# EAGLE schematic rev0.1 parts placement (EAGLE 8.6.0)

## Sheet 1 of 2
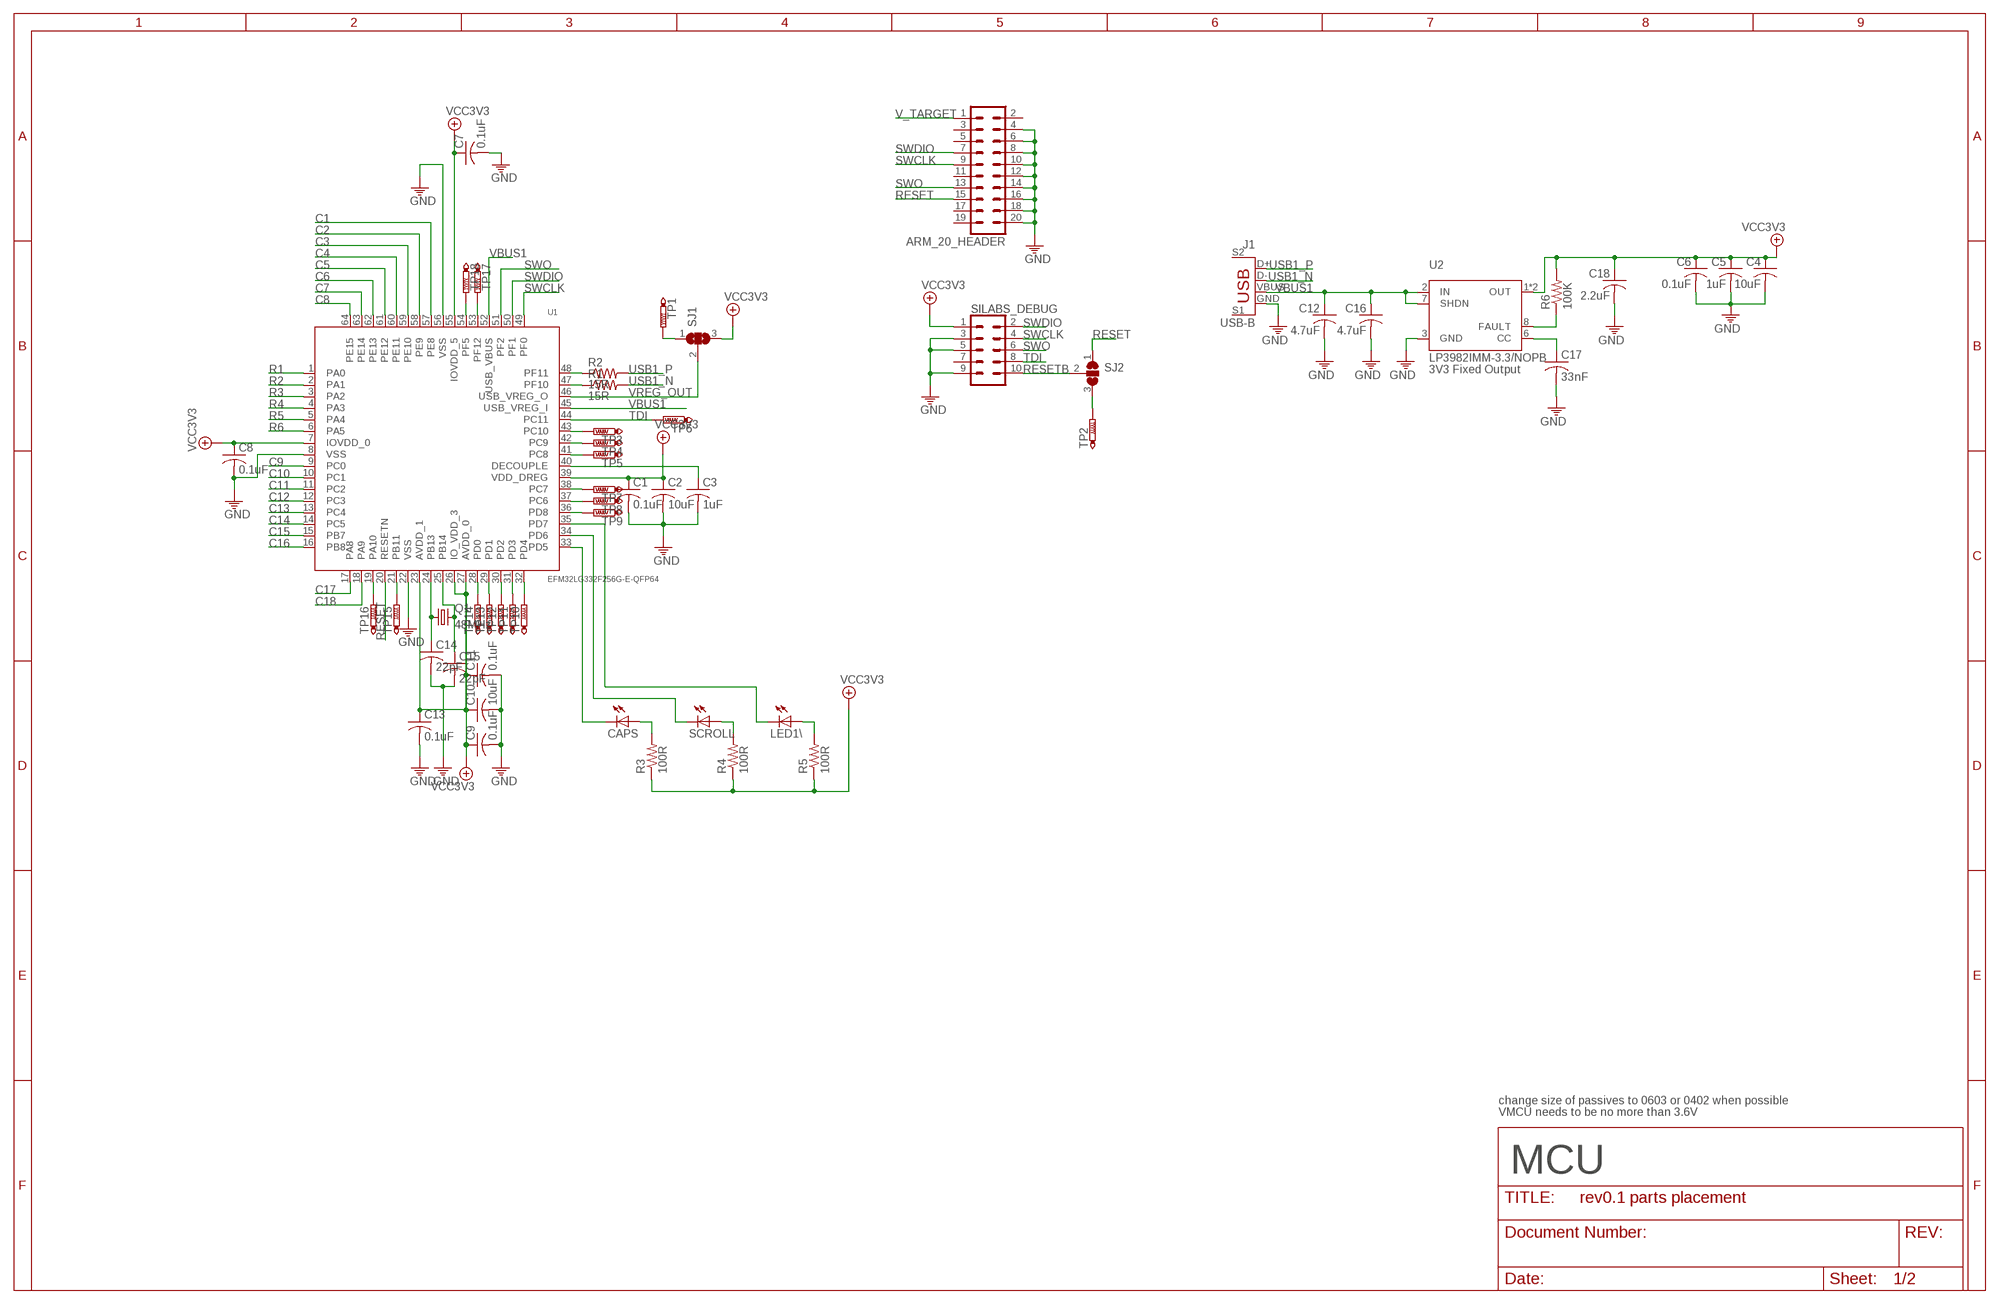
[diagram p0: schematic, sheet 1]

### Parts
ARM_20_HEADER  MA10-2  [MA10-2]
C1  0.1uF  C-USC0402  [C0402]
C2  10uF  C-USC0805  [C0805]
C3  1uF  C-USC0402  [C0402]
C4  10uF  C-USC0805  [C0805]
C5  1uF  C-USC0402  [C0402]
C6  0.1uF  C-USC0402  [C0402]
C7  0.1uF  C-USC0402  [C0402]
C8  0.1uF  C-USC0402  [C0402]
C9  0.1uF  C-USC0402  [C0402]
C10  10uF  C-USC0805  [C0805]
C11  0.1uF  C-USC0402  [C0402]
C12  4.7uF  C-USC0805  [C0805]
C13  0.1uF  C-USC0402  [C0402]
C14  22pF  C-USC0402  [C0402]
C15  22pF  C-USC0402  [C0402]
C16  4.7uF  C-USC0805  [C0805]
C17  33nF  C-USC0402  [C0402]
C18  2.2uF  C-USC0805  [C0805]
CAPS  LEDCHIP-LED0805  [CHIP-LED0805]
J1  USB-B  USBPTH  [USB-B-PTH]
LED1\  LEDCHIP-LED0805  [CHIP-LED0805]
Q1  48MHz  CRYSTALCTS406  [CTS406]
R1  15R  R-US_R0402  [R0402]
R2  15R  R-US_R0402  [R0402]
R3  100R  R-US_R0402  [R0402]
R4  100R  R-US_R0402  [R0402]
R5  100R  R-US_R0402  [R0402]
R6  100K  R-US_R0402  [R0402]
SCROLL  LEDCHIP-LED0805  [CHIP-LED0805]
SILABS_DEBUG  CONN_05X2SHD_LOCK  [2X5-SHROUDED_LOCK]
SJ1  SJ2W  [SJ_2]
SJ2  SJ2W  [SJ_2]
TP1  PTR1B2,54  [B2,54]
TP2  PTR1B2,54  [B2,54]
TP3  PTR1B1,27  [B1,27]
TP4  PTR1B1,27  [B1,27]
TP5  PTR1B1,27  [B1,27]
TP6  PTR1B1,27  [B1,27]
TP7  PTR1B1,27  [B1,27]
TP8  PTR1B1,27  [B1,27]
TP9  PTR1B1,27  [B1,27]
TP10  PTR1B1,27  [B1,27]
TP11  PTR1B1,27  [B1,27]
TP12  PTR1B1,27  [B1,27]
TP13  PTR1B1,27  [B1,27]
TP14  PTR1B1,27  [B1,27]
TP15  PTR1B1,27  [B1,27]
TP16  PTR1B1,27  [B1,27]
TP17  PTR1B1,27  [B1,27]
TP18  PTR1B1,27  [B1,27]
U1  EFM32LG332F256G-E-QFP64  [EFM32LG332F256G-E-QFP64]
U2  LP3982IMM-3.3/NOPB  [LP3982IMM-3.3/NOPB]

### Nets
1_N: R1.1 U1.47(PF10)
1_P: R2.1 U1.48(PF11)
C1: U1.57(PE8) ; also sheet 2
C2: U1.58(PE9) ; also sheet 2
C3: U1.59(PE10) ; also sheet 2
C4: U1.60(PE11) ; also sheet 2
C5: U1.61(PE12) ; also sheet 2
C6: U1.62(PE13) ; also sheet 2
C7: U1.63(PE14) ; also sheet 2
C8: U1.64(PE15) ; also sheet 2
C9: U1.9(PC0) ; also sheet 2
C10: U1.10(PC1) ; also sheet 2
C11: U1.11(PC2) ; also sheet 2
C12: U1.12(PC3) ; also sheet 2
C13: U1.13(PC4) ; also sheet 2
C14: U1.14(PC5) ; also sheet 2
C15: U1.15(PB7) ; also sheet 2
C16: U1.16(PB8) ; also sheet 2
C17: U1.17(PA8) ; also sheet 2
C18: U1.18(PA9) ; also sheet 2
GND: ARM_20_HEADER.4 ARM_20_HEADER.6 ARM_20_HEADER.8 ARM_20_HEADER.10 ARM_20_HEADER.12 ARM_20_HEADER.14 ARM_20_HEADER.16 ARM_20_HEADER.18 ARM_20_HEADER.20 C1.2 C2.2 C3.2 C4.2 C5.2 C6.2 C7.2 C8.2 C9.2 C10.2 C11.2 C12.2 C13.2 C14.2 C15.2 C16.2 C17.2 C18.2 J1.GND SILABS_DEBUG.3 SILABS_DEBUG.5 SILABS_DEBUG.9 U1.8(VSS) U1.22(VSS) U1.56(VSS) U2.3(GND)
N$1: SJ1.1 TP1.TP
N$2: C3.1 U1.40(DECOUPLE)
N$3: C15.1 Q1.3 U1.25(PB14)
N$4: C14.1 Q1.1 U1.24(PB13)
N$5: SJ2.3 TP2.TP
N$24: CAPS.A R3.2
N$25: R4.2 SCROLL.A
N$26: LED1\.A R5.2
N$27: CAPS.C U1.33(PD5)
N$28: SCROLL.C U1.34(PD6)
N$29: LED1\.C U1.35(PD7)
N$30: TP16.TP U1.19(PA10)
N$31: C17.1 U2.6(CC)
N$32: R6.1 U2.8(FAULT)
N$33: TP15.TP U1.21(PB11)
N$34: TP14.TP U1.28(PD0)
N$35: TP13.TP U1.29(PD1)
N$110: TP12.TP U1.30(PD2)
N$111: TP11.TP U1.31(PD3)
N$112: TP10.TP U1.32(PD4)
N$113: TP9.TP U1.36(PD8)
N$114: TP8.TP U1.37(PC6)
N$115: TP7.TP U1.38(PC7)
N$116: TP5.TP U1.41(PC8)
N$117: TP4.TP U1.42(PC9)
N$118: TP3.TP U1.43(PC10)
N$119: TP17.TP U1.53(PF12)
N$120: TP18.TP U1.54(PF5)
R1: U1.1(PA0) ; also sheet 2
R2: U1.2(PA1) ; also sheet 2
R3: U1.3(PA2) ; also sheet 2
R4: U1.4(PA3) ; also sheet 2
R5: U1.5(PA4) ; also sheet 2
R6: U1.6(PA5) ; also sheet 2
RESET: ARM_20_HEADER.15 SJ2.1 U1.20(RESETN)
RESETB: SILABS_DEBUG.10 SJ2.2
SWCLK: ARM_20_HEADER.9 SILABS_DEBUG.4 U1.49(PF0)
SWDIO: ARM_20_HEADER.7 SILABS_DEBUG.2 U1.50(PF1)
SWO: ARM_20_HEADER.13 SILABS_DEBUG.6 U1.51(PF2)
TDI: SILABS_DEBUG.8 TP6.TP U1.44(PC11)
USB1_N: J1.D- R1.2
USB1_P: J1.D+ R2.2
V_TARGET: ARM_20_HEADER.1
VBUS1: C12.1 C16.1 J1.VBUS U1.45(USB_VREG_I) U1.52(USB_VBUS) U2.2(IN) U2.7(SHDN)
VCC3V3: C1.1 C2.1 C4.1 C5.1 C6.1 C7.1 C8.1 C9.1 C10.1 C11.1 C13.1 C18.1 R3.1 R4.1 R5.1 R6.2 SILABS_DEBUG.1 SJ1.3 U1.7(IOVDD_0) U1.23(AVDD_1) U1.26(IO_VDD_3) U1.27(AVDD_0) U1.39(VDD_DREG) U1.55(IOVDD_5) U2.1(OUT) U2.4(OUT)
VREG_OUT: SJ1.2 U1.46(USB_VREG_O)
Unconnected: ARM_20_HEADER.2 ARM_20_HEADER.3 ARM_20_HEADER.5 ARM_20_HEADER.11 ARM_20_HEADER.17 ARM_20_HEADER.19 J1.S1(GND) J1.S2(GND) SILABS_DEBUG.7

### Notes on the sheet
- 3V3 Fixed Output
- change size of passives to 0603 or 0402 when possible
- VMCU needs to be no more than 3.6V
- MCU

## Sheet 2 of 2
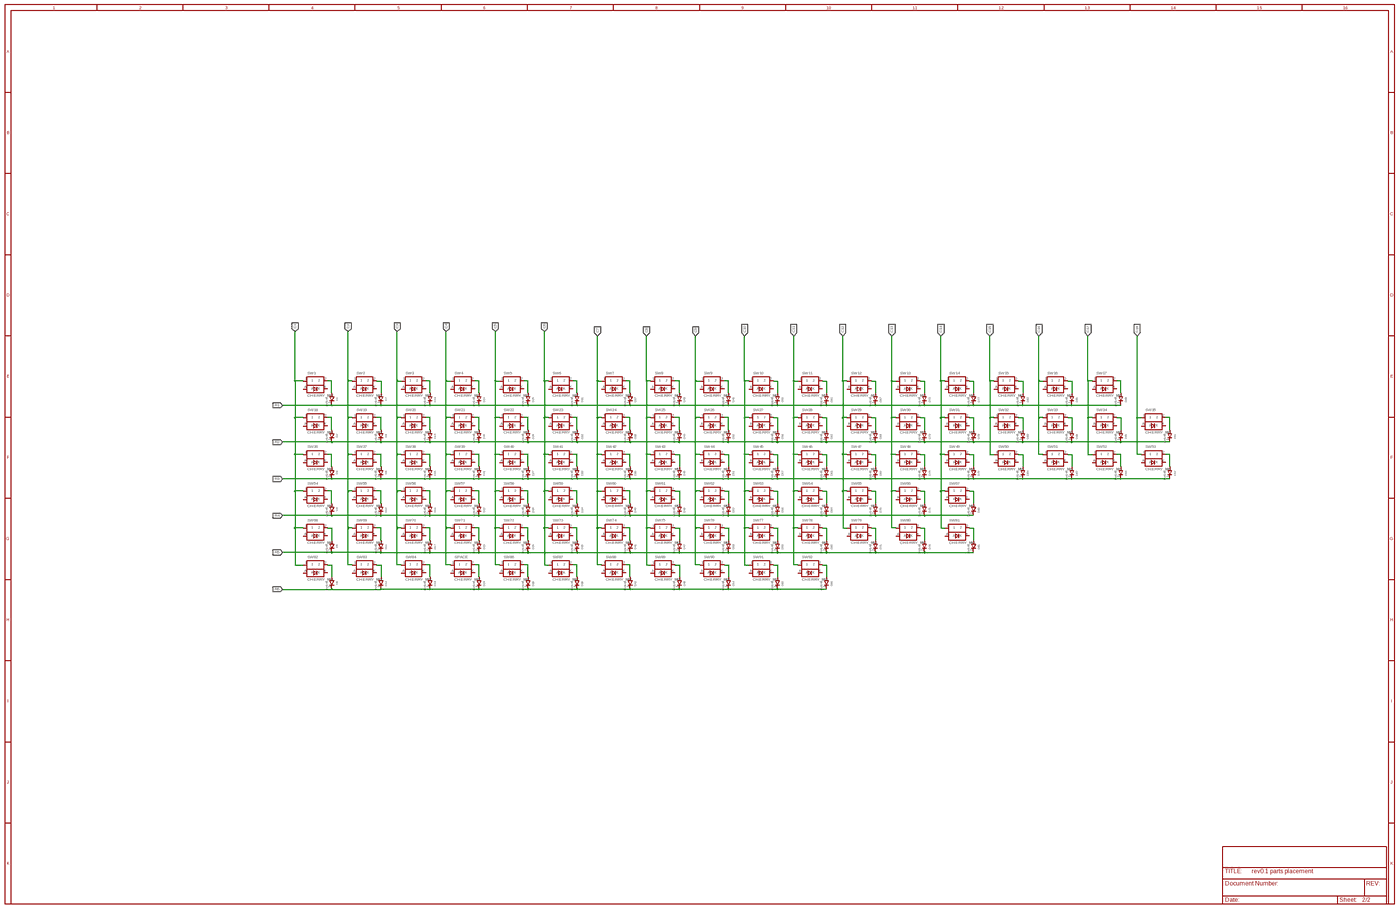
[diagram p1: schematic, sheet 2, overview]
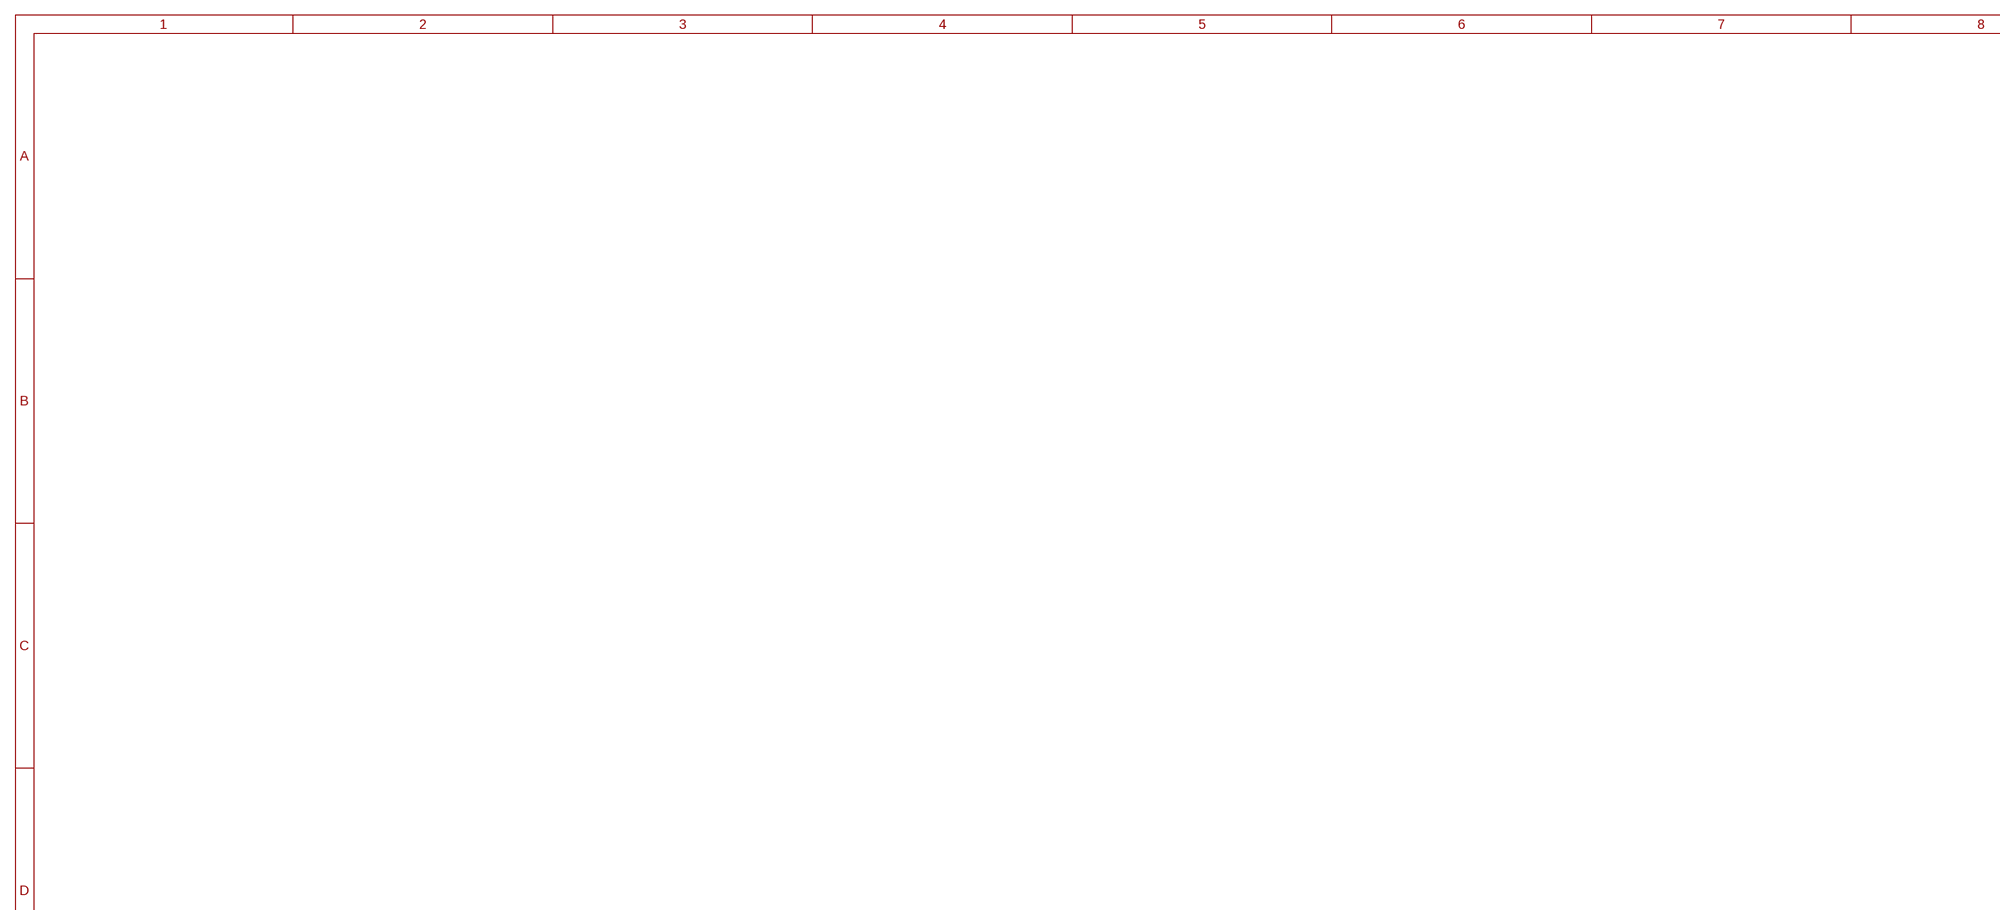
[diagram p2: schematic, sheet 2, part 1 of 4]
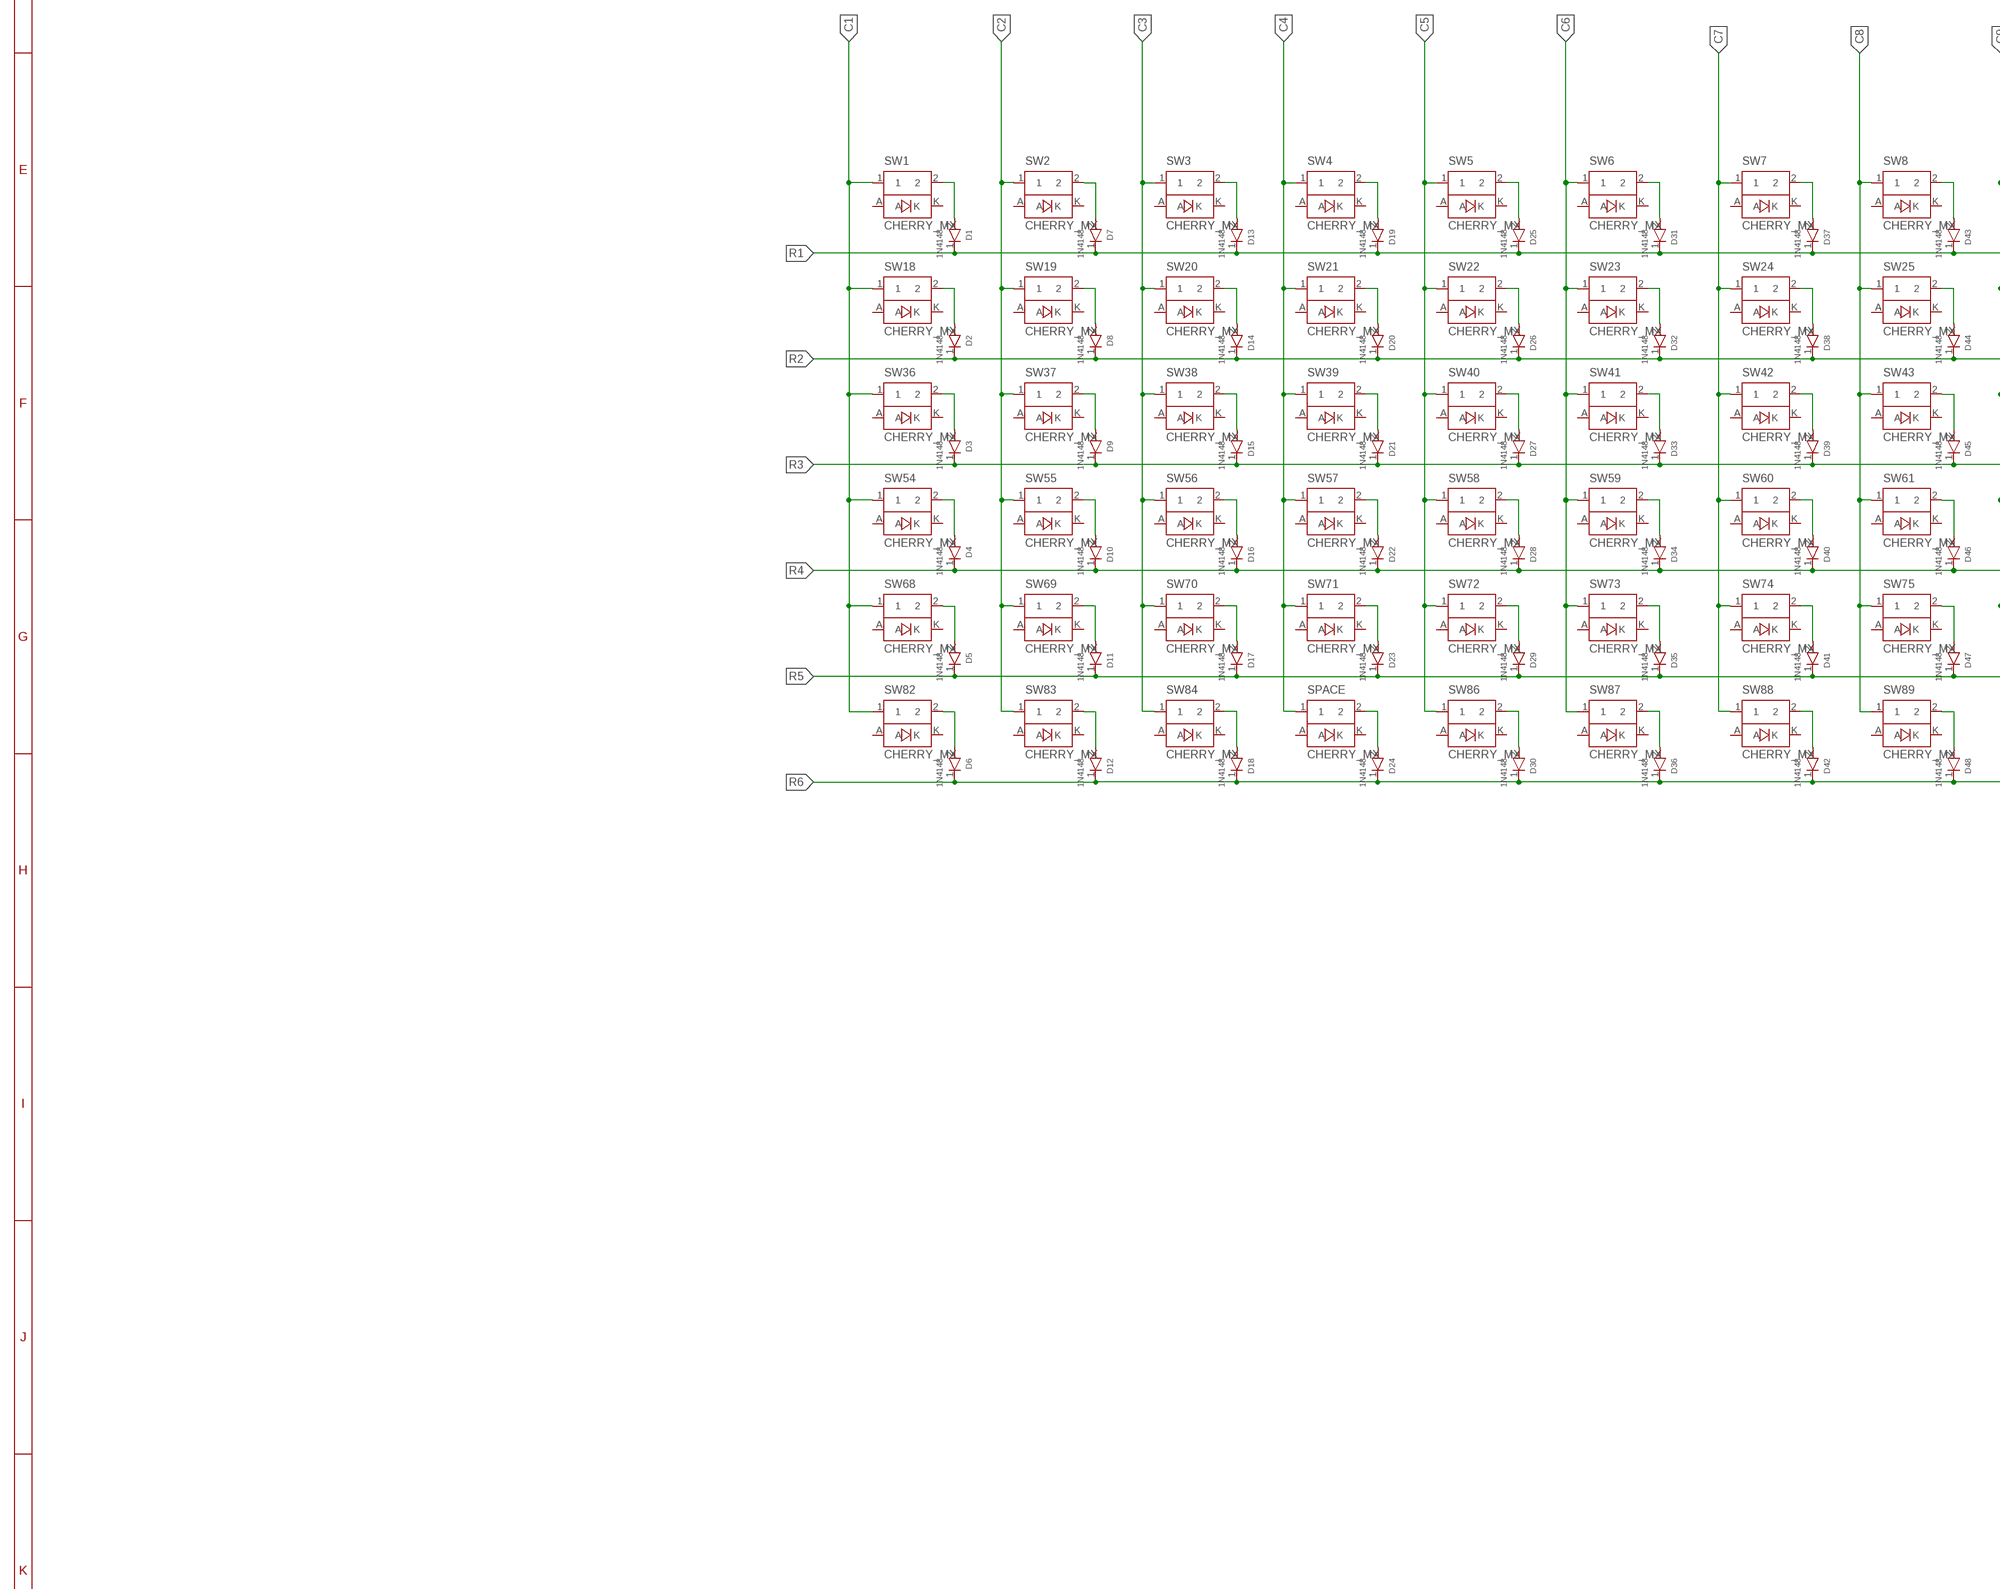
[diagram p3: schematic, sheet 2, part 2 of 4]
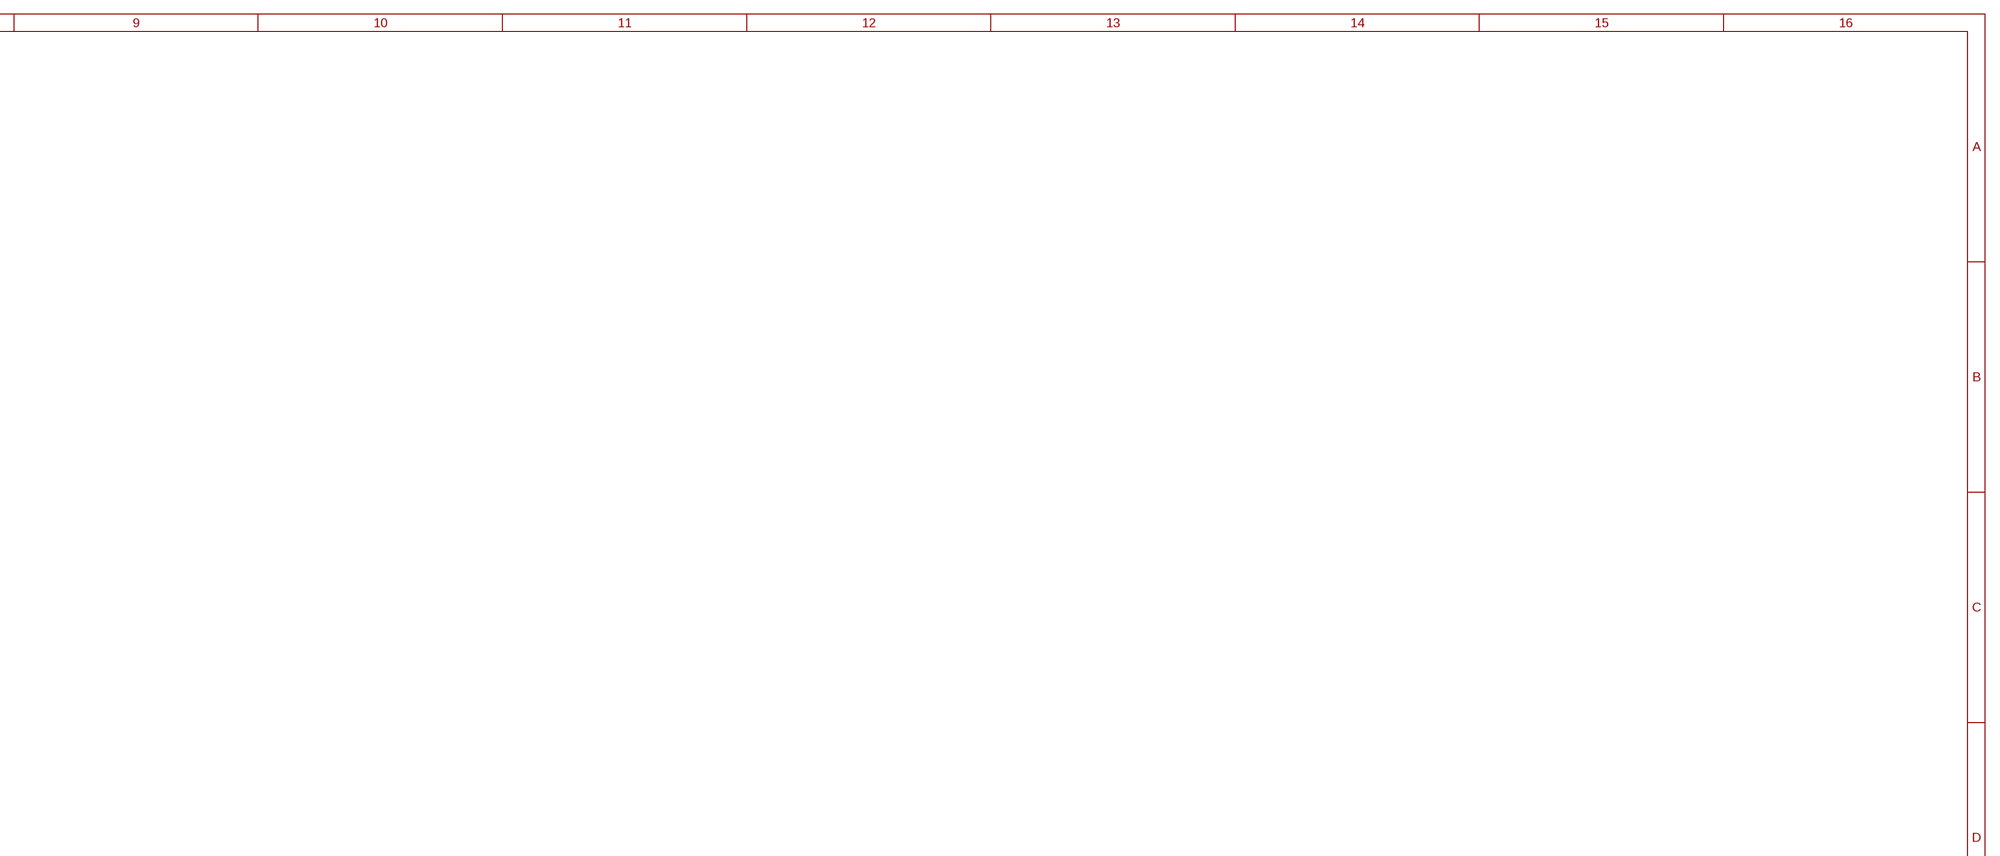
[diagram p4: schematic, sheet 2, part 3 of 4]
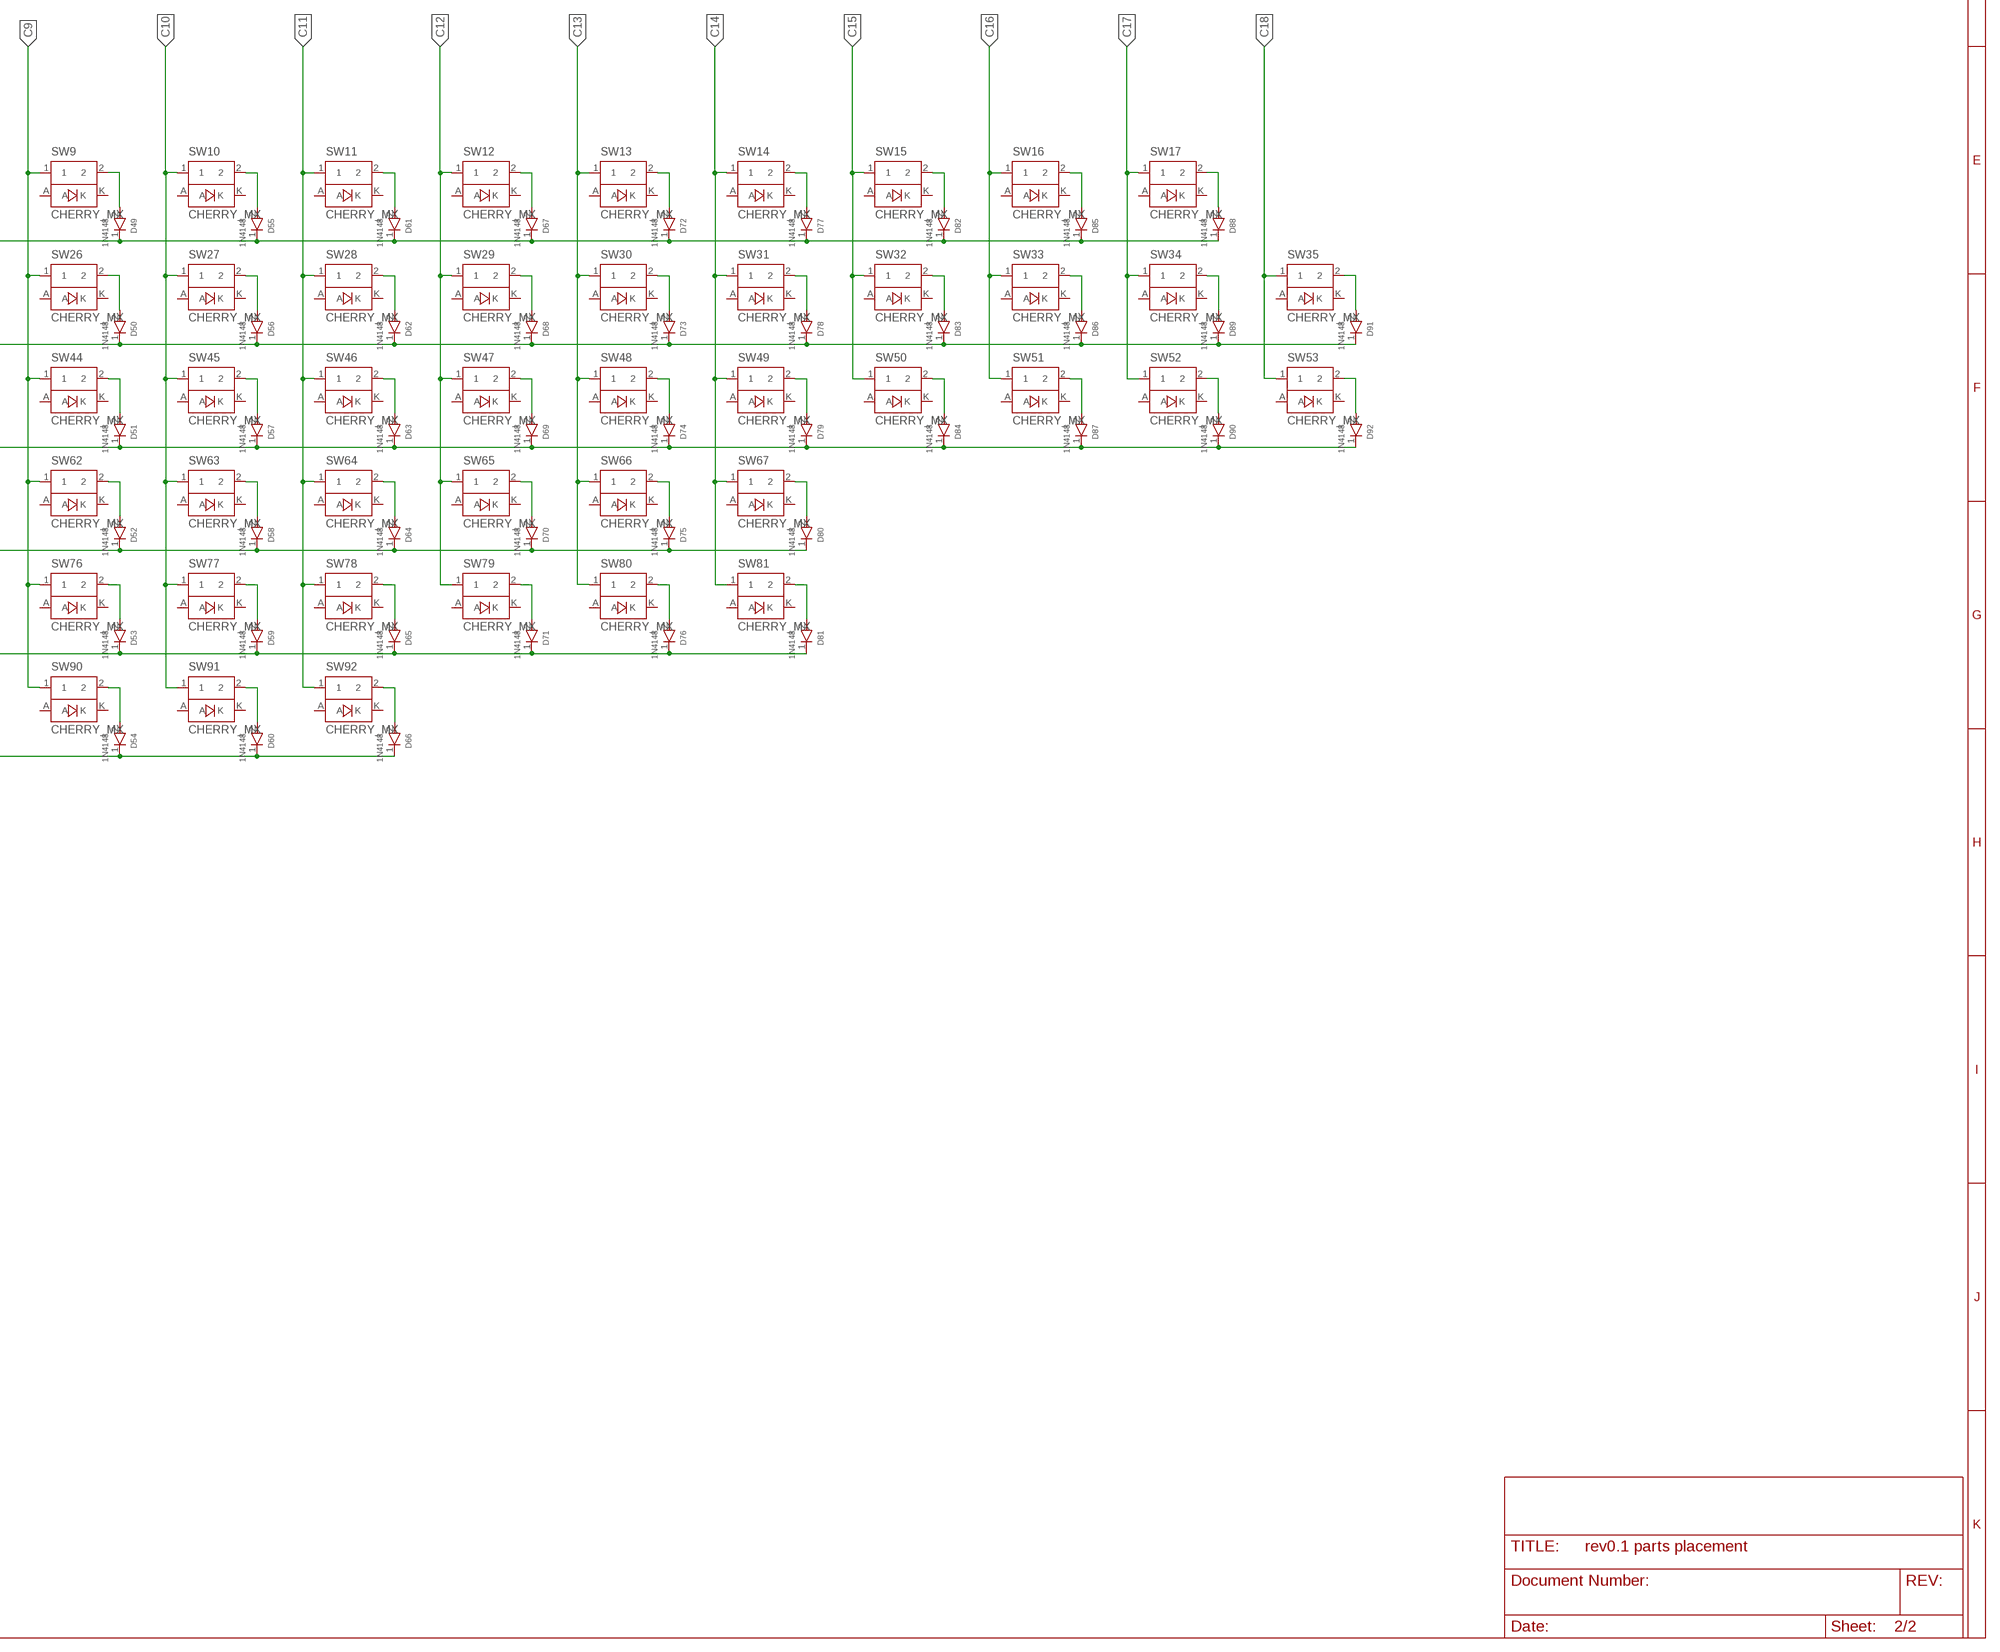
[diagram p5: schematic, sheet 2, part 4 of 4]

### Parts
D1  1N4148  [SOD323]
D2  1N4148  [SOD323]
D3  1N4148  [SOD323]
D4  1N4148  [SOD323]
D5  1N4148  [SOD323]
D6  1N4148  [SOD323]
D7  1N4148  [SOD323]
D8  1N4148  [SOD323]
D9  1N4148  [SOD323]
D10  1N4148  [SOD323]
D11  1N4148  [SOD323]
D12  1N4148  [SOD323]
D13  1N4148  [SOD323]
D14  1N4148  [SOD323]
D15  1N4148  [SOD323]
D16  1N4148  [SOD323]
D17  1N4148  [SOD323]
D18  1N4148  [SOD323]
D19  1N4148  [SOD323]
D20  1N4148  [SOD323]
D21  1N4148  [SOD323]
D22  1N4148  [SOD323]
D23  1N4148  [SOD323]
D24  1N4148  [SOD323]
D25  1N4148  [SOD323]
D26  1N4148  [SOD323]
D27  1N4148  [SOD323]
D28  1N4148  [SOD323]
D29  1N4148  [SOD323]
D30  1N4148  [SOD323]
D31  1N4148  [SOD323]
D32  1N4148  [SOD323]
D33  1N4148  [SOD323]
D34  1N4148  [SOD323]
D35  1N4148  [SOD323]
D36  1N4148  [SOD323]
D37  1N4148  [SOD323]
D38  1N4148  [SOD323]
D39  1N4148  [SOD323]
D40  1N4148  [SOD323]
D41  1N4148  [SOD323]
D42  1N4148  [SOD323]
D43  1N4148  [SOD323]
D44  1N4148  [SOD323]
D45  1N4148  [SOD323]
D46  1N4148  [SOD323]
D47  1N4148  [SOD323]
D48  1N4148  [SOD323]
D49  1N4148  [SOD323]
D50  1N4148  [SOD323]
D51  1N4148  [SOD323]
D52  1N4148  [SOD323]
D53  1N4148  [SOD323]
D54  1N4148  [SOD323]
D55  1N4148  [SOD323]
D56  1N4148  [SOD323]
D57  1N4148  [SOD323]
D58  1N4148  [SOD323]
D59  1N4148  [SOD323]
D60  1N4148  [SOD323]
D61  1N4148  [SOD323]
D62  1N4148  [SOD323]
D63  1N4148  [SOD323]
D64  1N4148  [SOD323]
D65  1N4148  [SOD323]
D66  1N4148  [SOD323]
D67  1N4148  [SOD323]
D68  1N4148  [SOD323]
D69  1N4148  [SOD323]
D70  1N4148  [SOD323]
D71  1N4148  [SOD323]
D72  1N4148  [SOD323]
D73  1N4148  [SOD323]
D74  1N4148  [SOD323]
D75  1N4148  [SOD323]
D76  1N4148  [SOD323]
D77  1N4148  [SOD323]
D78  1N4148  [SOD323]
D79  1N4148  [SOD323]
D80  1N4148  [SOD323]
D81  1N4148  [SOD323]
D82  1N4148  [SOD323]
D83  1N4148  [SOD323]
D84  1N4148  [SOD323]
D85  1N4148  [SOD323]
D86  1N4148  [SOD323]
D87  1N4148  [SOD323]
D88  1N4148  [SOD323]
D89  1N4148  [SOD323]
D90  1N4148  [SOD323]
D91  1N4148  [SOD323]
D92  1N4148  [SOD323]
SPACE  CHERRY_MX  [CHERRY_MX]
SW1  CHERRY_MX  [CHERRY_MX]
SW2  CHERRY_MX  [CHERRY_MX]
SW3  CHERRY_MX  [CHERRY_MX]
SW4  CHERRY_MX  [CHERRY_MX]
SW5  CHERRY_MX  [CHERRY_MX]
SW6  CHERRY_MX  [CHERRY_MX]
SW7  CHERRY_MX  [CHERRY_MX]
SW8  CHERRY_MX  [CHERRY_MX]
SW9  CHERRY_MX  [CHERRY_MX]
SW10  CHERRY_MX  [CHERRY_MX]
SW11  CHERRY_MX  [CHERRY_MX]
SW12  CHERRY_MX  [CHERRY_MX]
SW13  CHERRY_MX  [CHERRY_MX]
SW14  CHERRY_MX  [CHERRY_MX]
SW15  CHERRY_MX  [CHERRY_MX]
SW16  CHERRY_MX  [CHERRY_MX]
SW17  CHERRY_MX  [CHERRY_MX]
SW18  CHERRY_MX  [CHERRY_MX]
SW19  CHERRY_MX  [CHERRY_MX]
SW20  CHERRY_MX  [CHERRY_MX]
SW21  CHERRY_MX  [CHERRY_MX]
SW22  CHERRY_MX  [CHERRY_MX]
SW23  CHERRY_MX  [CHERRY_MX]
SW24  CHERRY_MX  [CHERRY_MX]
SW25  CHERRY_MX  [CHERRY_MX]
SW26  CHERRY_MX  [CHERRY_MX]
SW27  CHERRY_MX  [CHERRY_MX]
SW28  CHERRY_MX  [CHERRY_MX]
SW29  CHERRY_MX  [CHERRY_MX]
SW30  CHERRY_MX  [CHERRY_MX]
SW31  CHERRY_MX  [CHERRY_MX]
SW32  CHERRY_MX  [CHERRY_MX]
SW33  CHERRY_MX  [CHERRY_MX]
SW34  CHERRY_MX  [CHERRY_MX]
SW35  CHERRY_MX  [CHERRY_MX]
SW36  CHERRY_MX  [CHERRY_MX]
SW37  CHERRY_MX  [CHERRY_MX]
SW38  CHERRY_MX  [CHERRY_MX]
SW39  CHERRY_MX  [CHERRY_MX]
SW40  CHERRY_MX  [CHERRY_MX]
SW41  CHERRY_MX  [CHERRY_MX]
SW42  CHERRY_MX  [CHERRY_MX]
SW43  CHERRY_MX  [CHERRY_MX]
SW44  CHERRY_MX  [CHERRY_MX]
SW45  CHERRY_MX  [CHERRY_MX]
SW46  CHERRY_MX  [CHERRY_MX]
SW47  CHERRY_MX  [CHERRY_MX]
SW48  CHERRY_MX  [CHERRY_MX]
SW49  CHERRY_MX  [CHERRY_MX]
SW50  CHERRY_MX  [CHERRY_MX]
SW51  CHERRY_MX  [CHERRY_MX]
SW52  CHERRY_MX  [CHERRY_MX]
SW53  CHERRY_MX  [CHERRY_MX]
SW54  CHERRY_MX  [CHERRY_MX]
SW55  CHERRY_MX  [CHERRY_MX]
SW56  CHERRY_MX  [CHERRY_MX]
SW57  CHERRY_MX  [CHERRY_MX]
SW58  CHERRY_MX  [CHERRY_MX]
SW59  CHERRY_MX  [CHERRY_MX]
SW60  CHERRY_MX  [CHERRY_MX]
SW61  CHERRY_MX  [CHERRY_MX]
SW62  CHERRY_MX  [CHERRY_MX]
SW63  CHERRY_MX  [CHERRY_MX]
SW64  CHERRY_MX  [CHERRY_MX]
SW65  CHERRY_MX  [CHERRY_MX]
SW66  CHERRY_MX  [CHERRY_MX]
SW67  CHERRY_MX  [CHERRY_MX]
SW68  CHERRY_MX  [CHERRY_MX]
SW69  CHERRY_MX  [CHERRY_MX]
SW70  CHERRY_MX  [CHERRY_MX]
SW71  CHERRY_MX  [CHERRY_MX]
SW72  CHERRY_MX  [CHERRY_MX]
SW73  CHERRY_MX  [CHERRY_MX]
SW74  CHERRY_MX  [CHERRY_MX]
SW75  CHERRY_MX  [CHERRY_MX]
SW76  CHERRY_MX  [CHERRY_MX]
SW77  CHERRY_MX  [CHERRY_MX]
SW78  CHERRY_MX  [CHERRY_MX]
SW79  CHERRY_MX  [CHERRY_MX]
SW80  CHERRY_MX  [CHERRY_MX]
SW81  CHERRY_MX  [CHERRY_MX]
SW82  CHERRY_MX  [CHERRY_MX]
SW83  CHERRY_MX  [CHERRY_MX]
SW84  CHERRY_MX  [CHERRY_MX]
SW86  CHERRY_MX  [CHERRY_MX]
SW87  CHERRY_MX  [CHERRY_MX]
SW88  CHERRY_MX  [CHERRY_MX]
SW89  CHERRY_MX  [CHERRY_MX]
SW90  CHERRY_MX  [CHERRY_MX]
SW91  CHERRY_MX  [CHERRY_MX]
SW92  CHERRY_MX  [CHERRY_MX]

### Nets
C1: SW1.1 SW18.1 SW36.1 SW54.1 SW68.1 SW82.1 ; also sheet 1
C2: SW2.1 SW19.1 SW37.1 SW55.1 SW69.1 SW83.1 ; also sheet 1
C3: SW3.1 SW20.1 SW38.1 SW56.1 SW70.1 SW84.1 ; also sheet 1
C4: SPACE.1 SW4.1 SW21.1 SW39.1 SW57.1 SW71.1 ; also sheet 1
C5: SW5.1 SW22.1 SW40.1 SW58.1 SW72.1 SW86.1 ; also sheet 1
C6: SW6.1 SW23.1 SW41.1 SW59.1 SW73.1 SW87.1 ; also sheet 1
C7: SW7.1 SW24.1 SW42.1 SW60.1 SW74.1 SW88.1 ; also sheet 1
C8: SW8.1 SW25.1 SW43.1 SW61.1 SW75.1 SW89.1 ; also sheet 1
C9: SW9.1 SW26.1 SW44.1 SW62.1 SW76.1 SW90.1 ; also sheet 1
C10: SW10.1 SW27.1 SW45.1 SW63.1 SW77.1 SW91.1 ; also sheet 1
C11: SW11.1 SW28.1 SW46.1 SW64.1 SW78.1 SW92.1 ; also sheet 1
C12: SW12.1 SW29.1 SW47.1 SW65.1 SW79.1 ; also sheet 1
C13: SW13.1 SW30.1 SW48.1 SW66.1 SW80.1 ; also sheet 1
C14: SW14.1 SW31.1 SW49.1 SW67.1 SW81.1 ; also sheet 1
C15: SW15.1 SW32.1 SW50.1 ; also sheet 1
C16: SW16.1 SW33.1 SW51.1 ; also sheet 1
C17: SW17.1 SW34.1 SW52.1 ; also sheet 1
C18: SW35.1 SW53.1 ; also sheet 1
N$6: D88.2 SW17.2
N$7: D6.2 SW82.2
N$8: D5.2 SW68.2
N$9: D4.2 SW54.2
N$10: D3.2 SW36.2
N$11: D2.2 SW18.2
N$12: D1.2 SW1.2
N$13: D91.2 SW35.2
N$14: D7.2 SW2.2
N$15: D12.2 SW83.2
N$16: D11.2 SW69.2
N$17: D10.2 SW55.2
N$18: D9.2 SW37.2
N$19: D8.2 SW19.2
N$20: D92.2 SW53.2
N$21: D90.2 SW52.2
N$22: D89.2 SW34.2
N$23: D85.2 SW16.2
N$36: D14.2 SW20.2
N$37: D13.2 SW3.2
N$38: D15.2 SW38.2
N$39: D21.2 SW39.2
N$40: D20.2 SW21.2
N$41: D22.2 SW57.2
N$42: D16.2 SW56.2
N$43: D17.2 SW70.2
N$44: D23.2 SW71.2
N$45: D24.2 SPACE.2
N$46: D18.2 SW84.2
N$47: D19.2 SW4.2
N$48: D25.2 SW5.2
N$49: D31.2 SW6.2
N$50: D26.2 SW22.2
N$51: D32.2 SW23.2
N$52: D33.2 SW41.2
N$53: D27.2 SW40.2
N$54: D28.2 SW58.2
N$55: D34.2 SW59.2
N$56: D35.2 SW73.2
N$57: D29.2 SW72.2
N$58: D30.2 SW86.2
N$59: D36.2 SW87.2
N$60: D86.2 SW33.2
N$61: D87.2 SW51.2
N$62: D84.2 SW50.2
N$63: D83.2 SW32.2
N$64: D82.2 SW15.2
N$65: D77.2 SW14.2
N$66: D78.2 SW31.2
N$67: D79.2 SW49.2
N$68: D80.2 SW67.2
N$69: D81.2 SW81.2
N$70: D76.2 SW80.2
N$71: D75.2 SW66.2
N$72: D70.2 SW65.2
N$73: D71.2 SW79.2
N$74: D69.2 SW47.2
N$75: D74.2 SW48.2
N$76: D73.2 SW30.2
N$77: D68.2 SW29.2
N$78: D67.2 SW12.2
N$79: D72.2 SW13.2
N$80: D61.2 SW11.2
N$81: D55.2 SW10.2
N$82: D56.2 SW27.2
N$83: D62.2 SW28.2
N$84: D63.2 SW46.2
N$85: D57.2 SW45.2
N$86: D58.2 SW63.2
N$87: D64.2 SW64.2
N$88: D65.2 SW78.2
N$89: D59.2 SW77.2
N$90: D60.2 SW91.2
N$91: D66.2 SW92.2
N$92: D48.2 SW89.2
N$93: D54.2 SW90.2
N$94: D47.2 SW75.2
N$95: D53.2 SW76.2
N$96: D52.2 SW62.2
N$97: D46.2 SW61.2
N$98: D45.2 SW43.2
N$99: D51.2 SW44.2
N$100: D50.2 SW26.2
N$101: D44.2 SW25.2
N$102: D43.2 SW8.2
N$103: D49.2 SW9.2
N$104: D37.2 SW7.2
N$105: D38.2 SW24.2
N$106: D39.2 SW42.2
N$107: D40.2 SW60.2
N$108: D41.2 SW74.2
N$109: D42.2 SW88.2
R1: D1.1 D7.1 D13.1 D19.1 D25.1 D31.1 D37.1 D43.1 D49.1 D55.1 D61.1 D67.1 D72.1 D77.1 D82.1 D85.1 D88.1 ; also sheet 1
R2: D2.1 D8.1 D14.1 D20.1 D26.1 D32.1 D38.1 D44.1 D50.1 D56.1 D62.1 D68.1 D73.1 D78.1 D83.1 D86.1 D89.1 D91.1 ; also sheet 1
R3: D3.1 D9.1 D15.1 D21.1 D27.1 D33.1 D39.1 D45.1 D51.1 D57.1 D63.1 D69.1 D74.1 D79.1 D84.1 D87.1 D90.1 D92.1 ; also sheet 1
R4: D4.1 D10.1 D16.1 D22.1 D28.1 D34.1 D40.1 D46.1 D52.1 D58.1 D64.1 D70.1 D75.1 D80.1 ; also sheet 1
R5: D5.1 D11.1 D17.1 D23.1 D29.1 D35.1 D41.1 D47.1 D53.1 D59.1 D65.1 D71.1 D76.1 D81.1 ; also sheet 1
R6: D6.1 D12.1 D18.1 D24.1 D30.1 D36.1 D42.1 D48.1 D54.1 D60.1 D66.1 ; also sheet 1
Unconnected: SPACE.A SPACE.K SW1.A SW1.K SW2.A SW2.K SW3.A SW3.K SW4.A SW4.K SW5.A SW5.K SW6.A SW6.K SW7.A SW7.K SW8.A SW8.K SW9.A SW9.K SW10.A SW10.K SW11.A SW11.K SW12.A SW12.K SW13.A SW13.K SW14.A SW14.K SW15.A SW15.K SW16.A SW16.K SW17.A SW17.K SW18.A SW18.K SW19.A SW19.K SW20.A SW20.K SW21.A SW21.K SW22.A SW22.K SW23.A SW23.K SW24.A SW24.K SW25.A SW25.K SW26.A SW26.K SW27.A SW27.K SW28.A SW28.K SW29.A SW29.K SW30.A SW30.K SW31.A SW31.K SW32.A SW32.K SW33.A SW33.K SW34.A SW34.K SW35.A SW35.K SW36.A SW36.K SW37.A SW37.K SW38.A SW38.K SW39.A SW39.K SW40.A SW40.K SW41.A SW41.K SW42.A SW42.K SW43.A SW43.K SW44.A SW44.K SW45.A SW45.K SW46.A SW46.K SW47.A SW47.K SW48.A SW48.K SW49.A SW49.K SW50.A SW50.K SW51.A SW51.K SW52.A SW52.K SW53.A SW53.K SW54.A SW54.K SW55.A SW55.K SW56.A SW56.K SW57.A SW57.K SW58.A SW58.K SW59.A SW59.K SW60.A SW60.K SW61.A SW61.K SW62.A SW62.K SW63.A SW63.K SW64.A SW64.K SW65.A SW65.K SW66.A SW66.K SW67.A SW67.K SW68.A SW68.K SW69.A SW69.K SW70.A SW70.K SW71.A SW71.K SW72.A SW72.K SW73.A SW73.K SW74.A SW74.K SW75.A SW75.K SW76.A SW76.K SW77.A SW77.K SW78.A SW78.K SW79.A SW79.K SW80.A SW80.K SW81.A SW81.K SW82.A SW82.K SW83.A SW83.K SW84.A SW84.K SW86.A SW86.K SW87.A SW87.K SW88.A SW88.K SW89.A SW89.K SW90.A SW90.K SW91.A SW91.K SW92.A SW92.K

## Library data of the parts
ARM_20_HEADER = con-lstb:MA10-2: PIN HEADER; OC_FARNELL: unknown; OC_NEWARK: unknown
C1-C18 = resistor:C-US: CAPACITOR, American symbol
CAPS LED1\ SCROLL = adafruit:LED: LED OSRAM: - CHIPLED LG R971, LG N971, LY N971, LG Q971, LY Q971, LO R971, LY R971 LH N974, LH R974 LS Q976, LO Q976, LY Q976 LO Q996 - Hyper CHIPLED LW Q18S LB Q993, LB Q99A, LB R99A - SideLED LS A670, LO A670, LY A670, LG A670, LP A670 LB A673, LV A673, LT A673, LW A673 LH A674 LY A675 LS A676, LA A676, LO A676, LY A676, LW A676 LS A679, LY A679, LG A679 - Hyper Micro SIDELED® LS Y876, LA Y876, LO Y876, LY Y876 LT Y87S - SmartLED LW L88C, LW L88S LB L89C, LB L89S, LG L890 LS L89K, LO L89K, LY L89K LS L896, LA L896, LO L896, LY L896 - TOPLED LS T670, LO T670, LY T670, LG T670, LP T670 LSG T670, LSP T670, LSY T670, LOP T670, LYG T670 LG T671, LOG T671, LSG T671 LB T673, LV T673, LT T673, LW T673 LH T674 LS T676, LA T676, LO T676, LY T676, LB T676, LH T676, LSB T676, LW T676 LB T67C, LV T67C, LT T67C, LS T67K, LO T67K, LY T67K, LW E67C LS E67B, LA E67B, LO E67B, LY E67B, LB E67C, LV E67C, LT E67C LW T67C LS T679, LY T679, LG T679 LS T770, LO T770, LY T770, LG T770, LP T770 LB T773, LV T773, LT T773, LW T773 LH T774 LS E675, LA E675, LY E675, LS T675 LS T776, LA T776, LO T776, LY T776, LB T776 LHGB T686 LT T68C, LB T68C - Hyper Mini TOPLED® LB M676 - Mini TOPLED Santana® LG M470 LS M47K, LO M47K, LY M47K Source: http://www.osram.convergy.de/
D1-D92 = clackboard_lib:1N4148
J1 = SparkFun-Connectors:USB: USB Connectors USB-B-PTH is fully proven SKU : PRT-00139/CONN-08278 USB-miniB is fully proven SKU : PRT-00587 USB-A-PCB is untested. USB-A-H is throughly reviewed, but untested. Spark Fun Electronics SKU : PRT-00437 USB-B-SMT is throughly reviewed, but untested. Needs silkscreen touching up. USB-A-S has not been used/tested USB-MB-H has not been used/tested USB-MICROB has been used. CONN-09505; PROD_ID: CONN-08278
Q1 = adafruit:CRYSTAL: CRYSTAL; OC_FARNELL: unknown; OC_NEWARK: unknown
R1-R6 = resistor:R-US_: RESISTOR, American symbol
SILABS_DEBUG = SparkFun-Connectors:CONN_05X2: Multi connection point. Often used as Generic Header-pin footprint for 0.1 inch spaced/style header connections For AVR SPI programming port, see special device with nice symbol: "AVR_SPI_PROG_5x2.dev" You can populate with any combo of single row headers, but if you'd like an exact match, check these: 2x5 AVR ICSP Male Header <https://www.sparkfun.com/products/778> (PRT-00778) 2x5 Pin Shrouded Header <https://www.sparkfun.com/products/8506> (PRT-08506) On any of the 0.1 inch spaced packages, you can populate with these: Break Away Headers - Straight <https://www.sparkfun.com/products/116> (PRT-00116) Break Away Male Headers - Right Angle <https://www.sparkfun.com/products/553> (PRT-00553) Female Headers <https://www.sparkfun.com/products/115> (PRT-00115) Break Away Headers - Machine Pin <https://www.sparkfun.com/products/117> (PRT-00117) Break Away Female Headers - Swiss Machine Pin <https://www.sparkfun.com/products/743> (PRT-00743) Special note: the shrouded connector mates well with our 5x2 ribbon cables: 2x5 Pin IDC Ribbon Cable <https://www.sparkfun.com/products/8535> (PRT-08535); PROD_ID: CONN-08671; SF_ID: PRT-08506
SJ1 SJ2 = jumper:SJ2W: SMD solder JUMPER
SPACE SW1-SW84 SW86-SW92 = ALLEYBEACH_LIB:CHERRY_MX
TP1-TP18 = testpad:PTR1: TEST PIN
U1 = clackboard_lib:EFM32LG332F256G-E-QFP64
U2 = clackboard_lib:LP3982IMM-3.3/NOPB